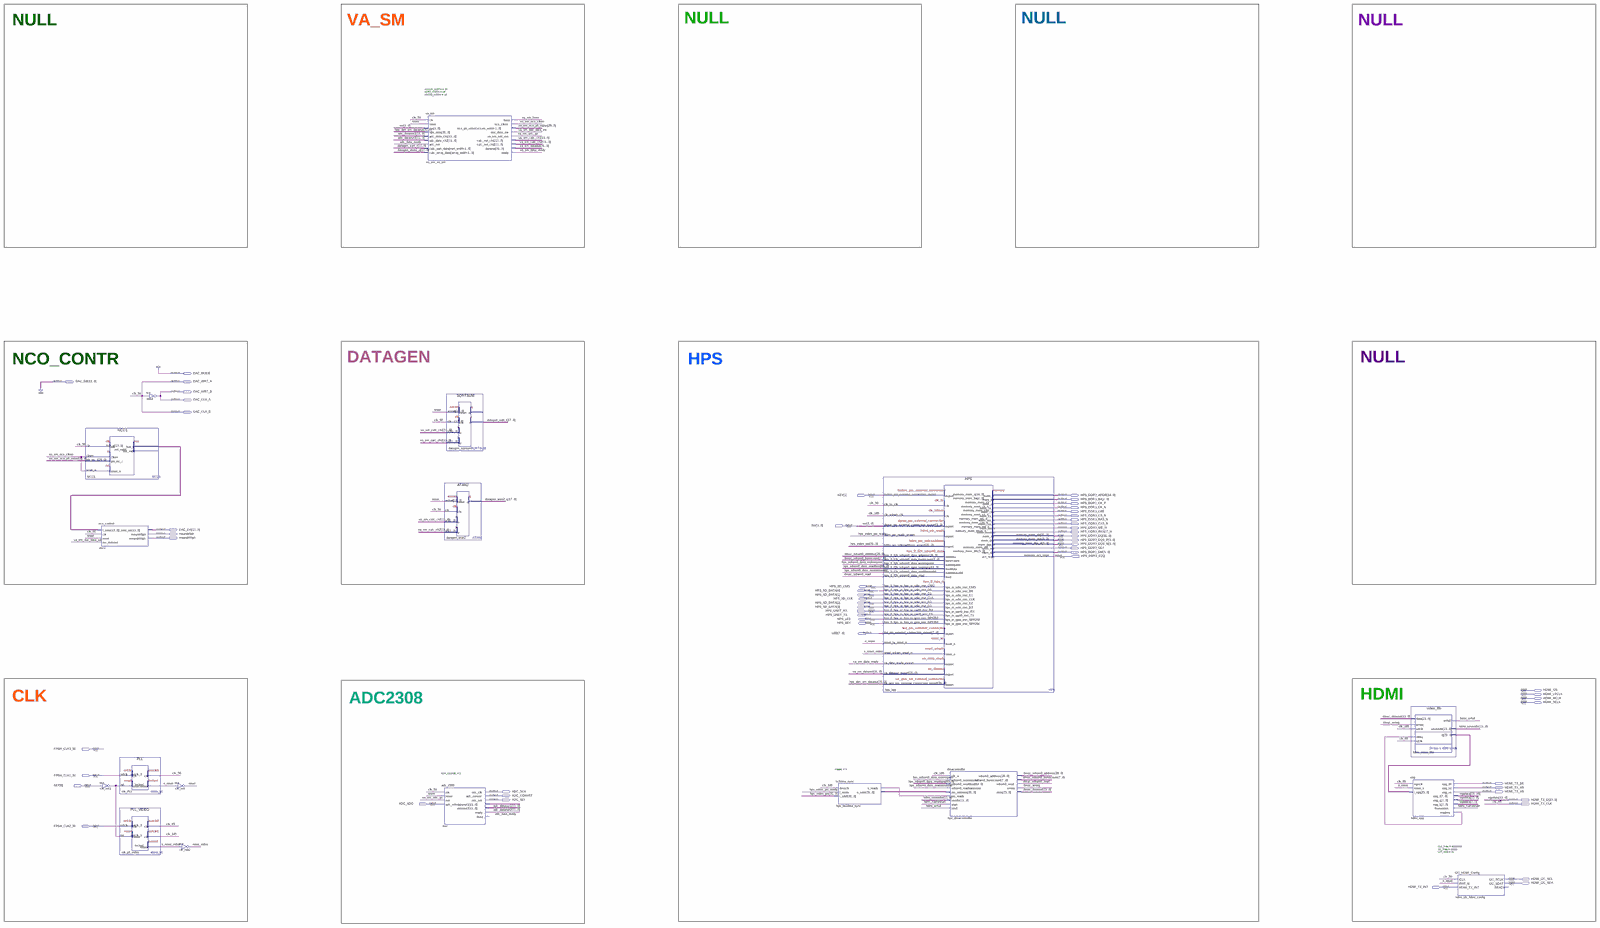
[diagram p0: schematic sheet, whole]
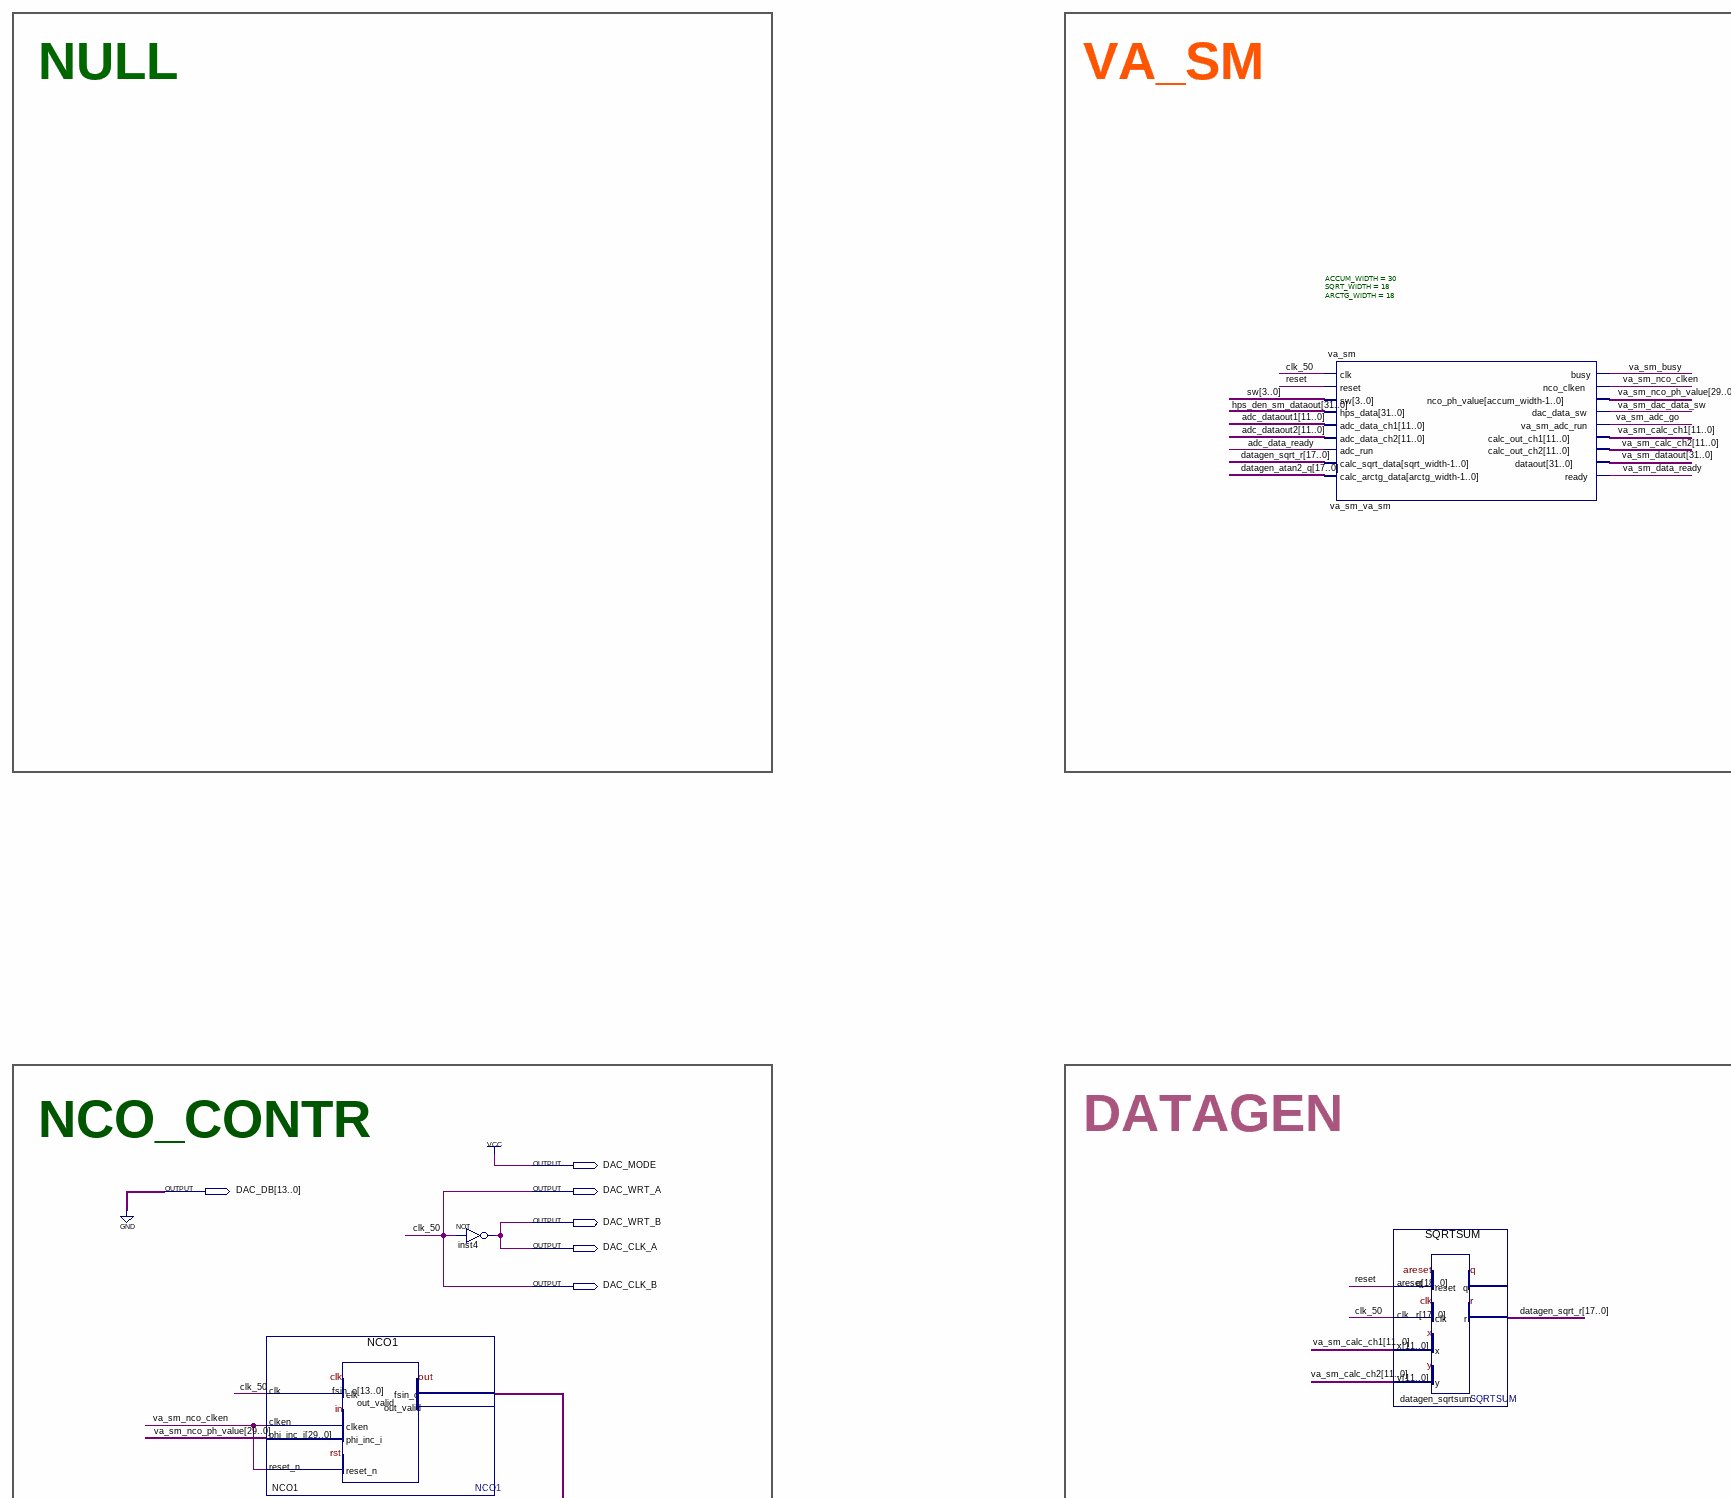
[diagram p1: schematic sheet, upper left part]
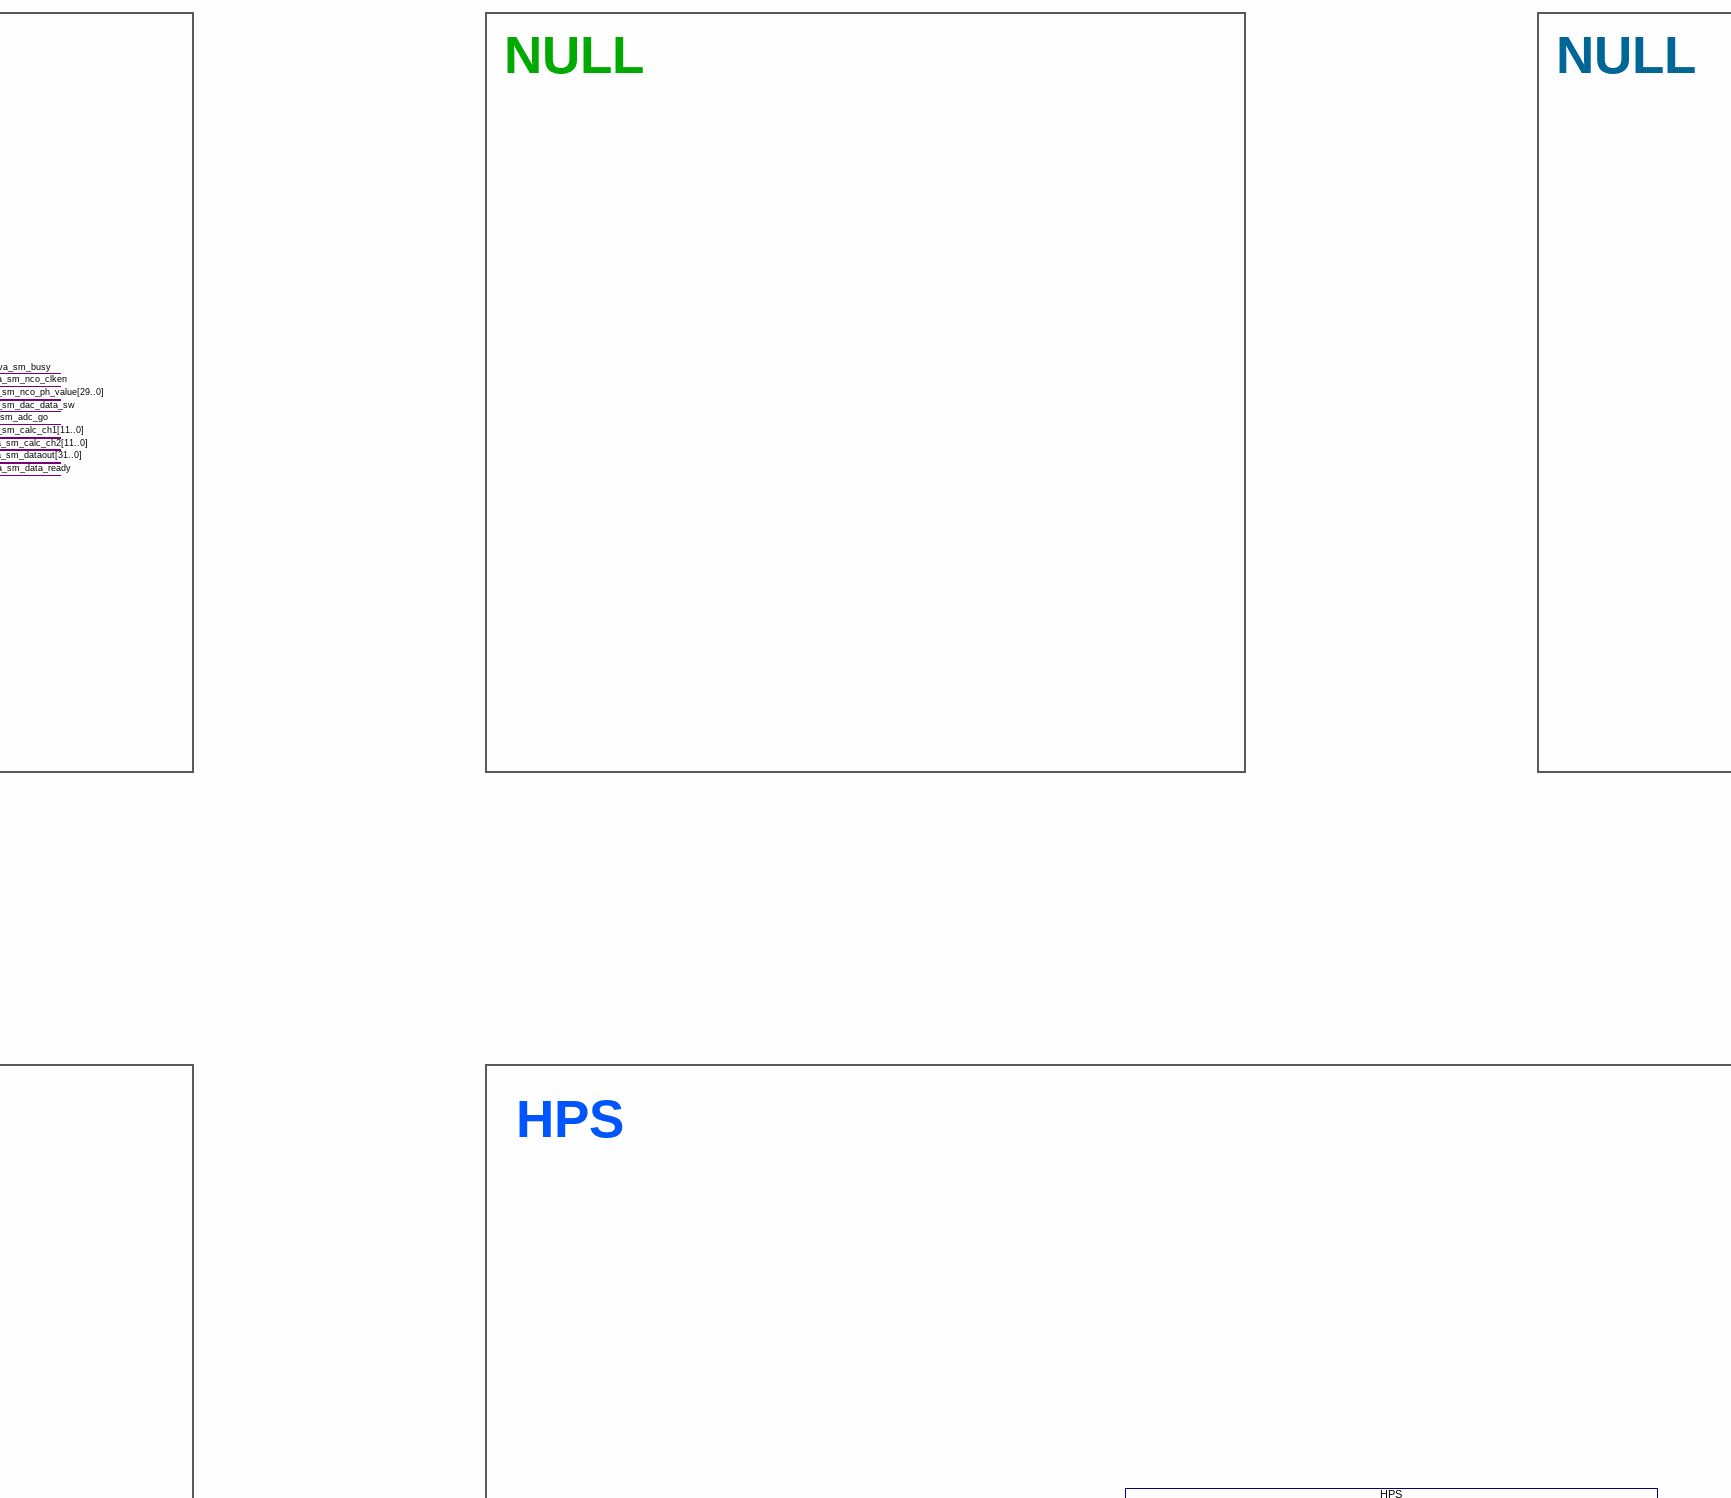
[diagram p2: schematic sheet, upper centre part]
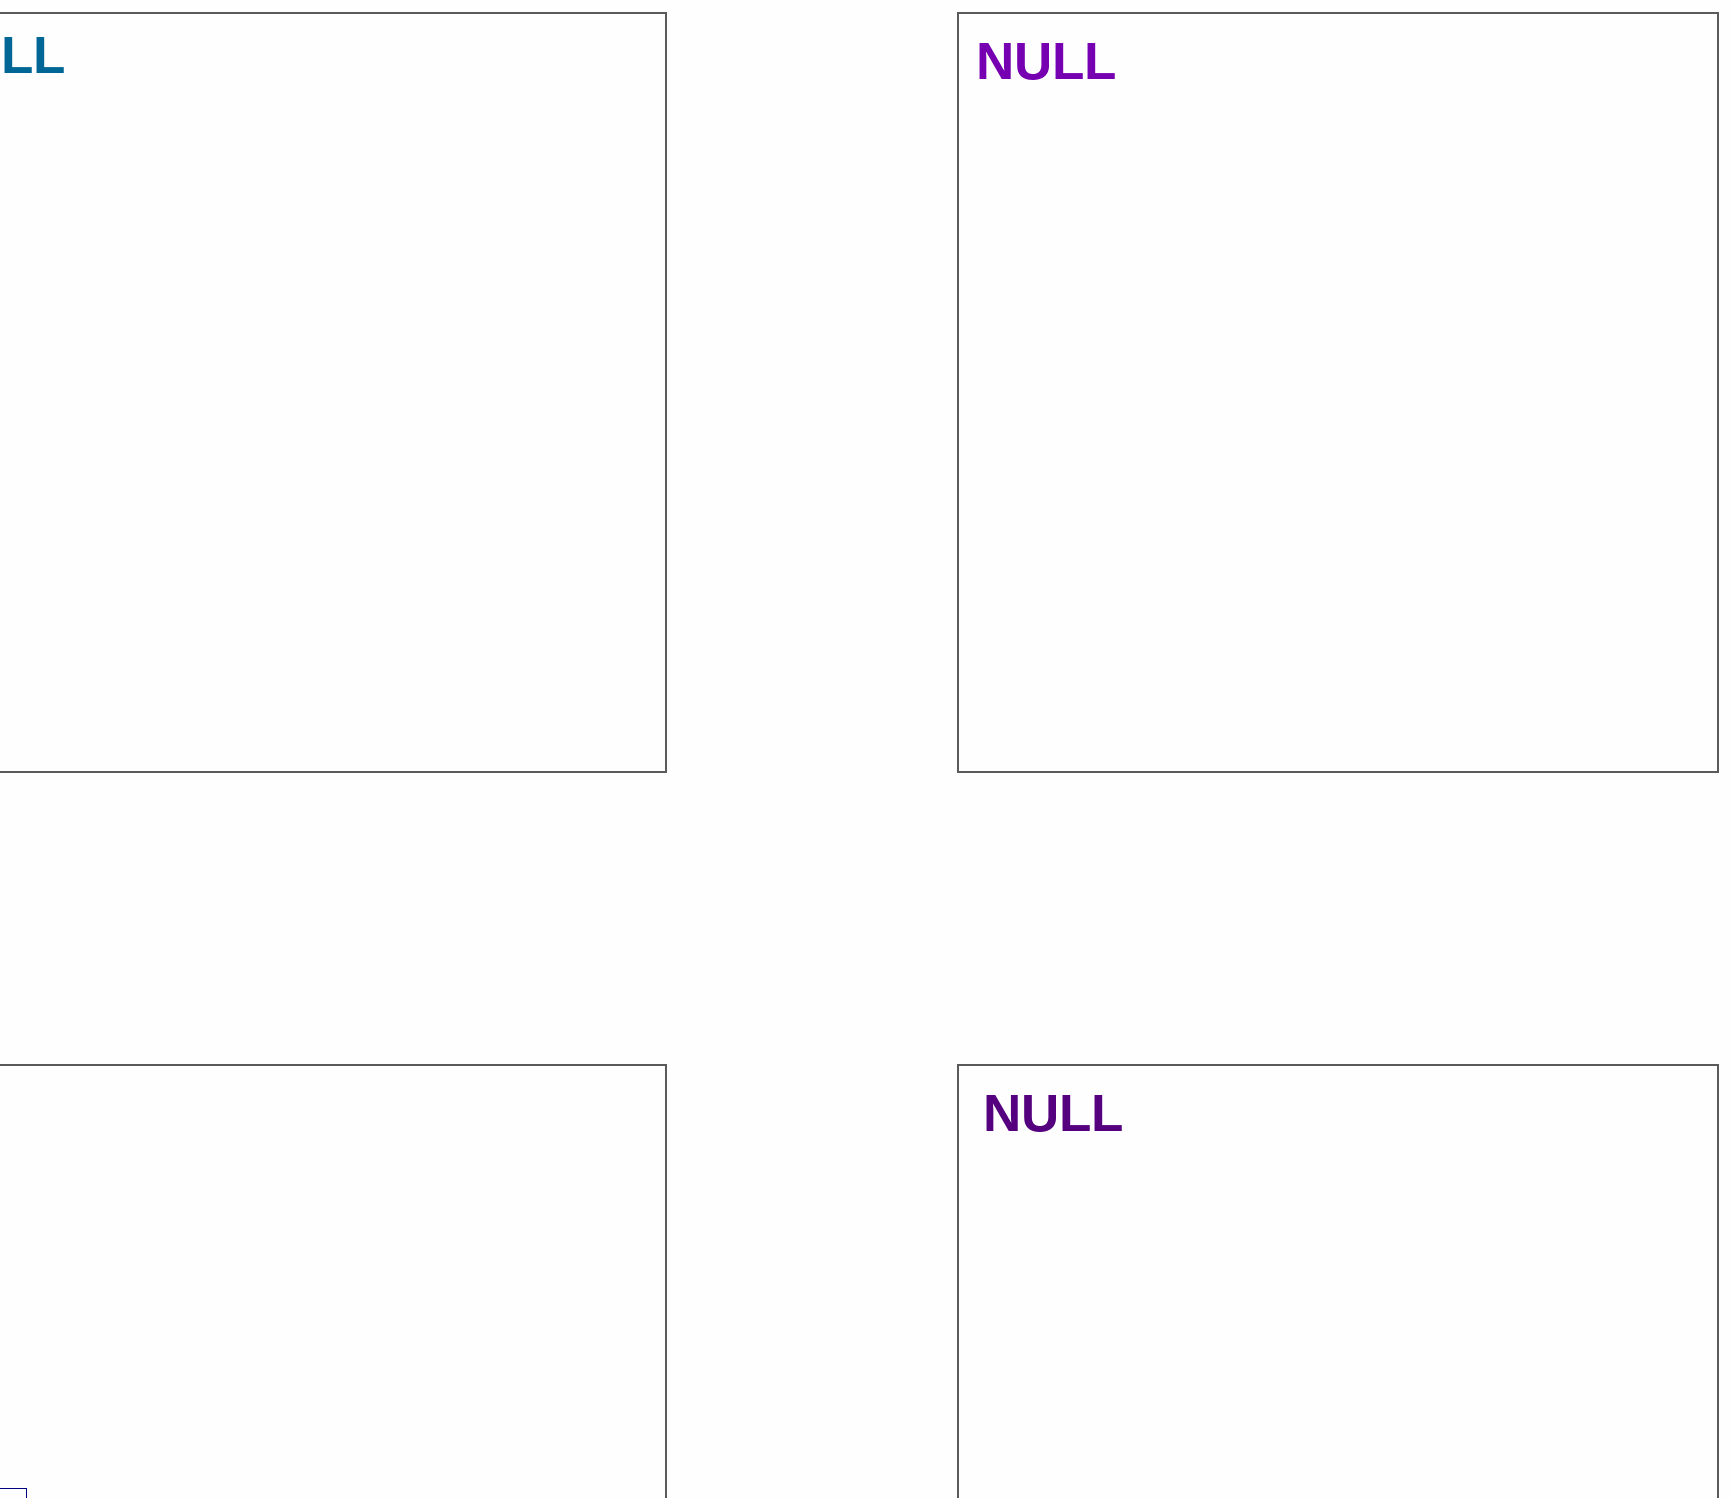
[diagram p3: schematic sheet, upper right part]
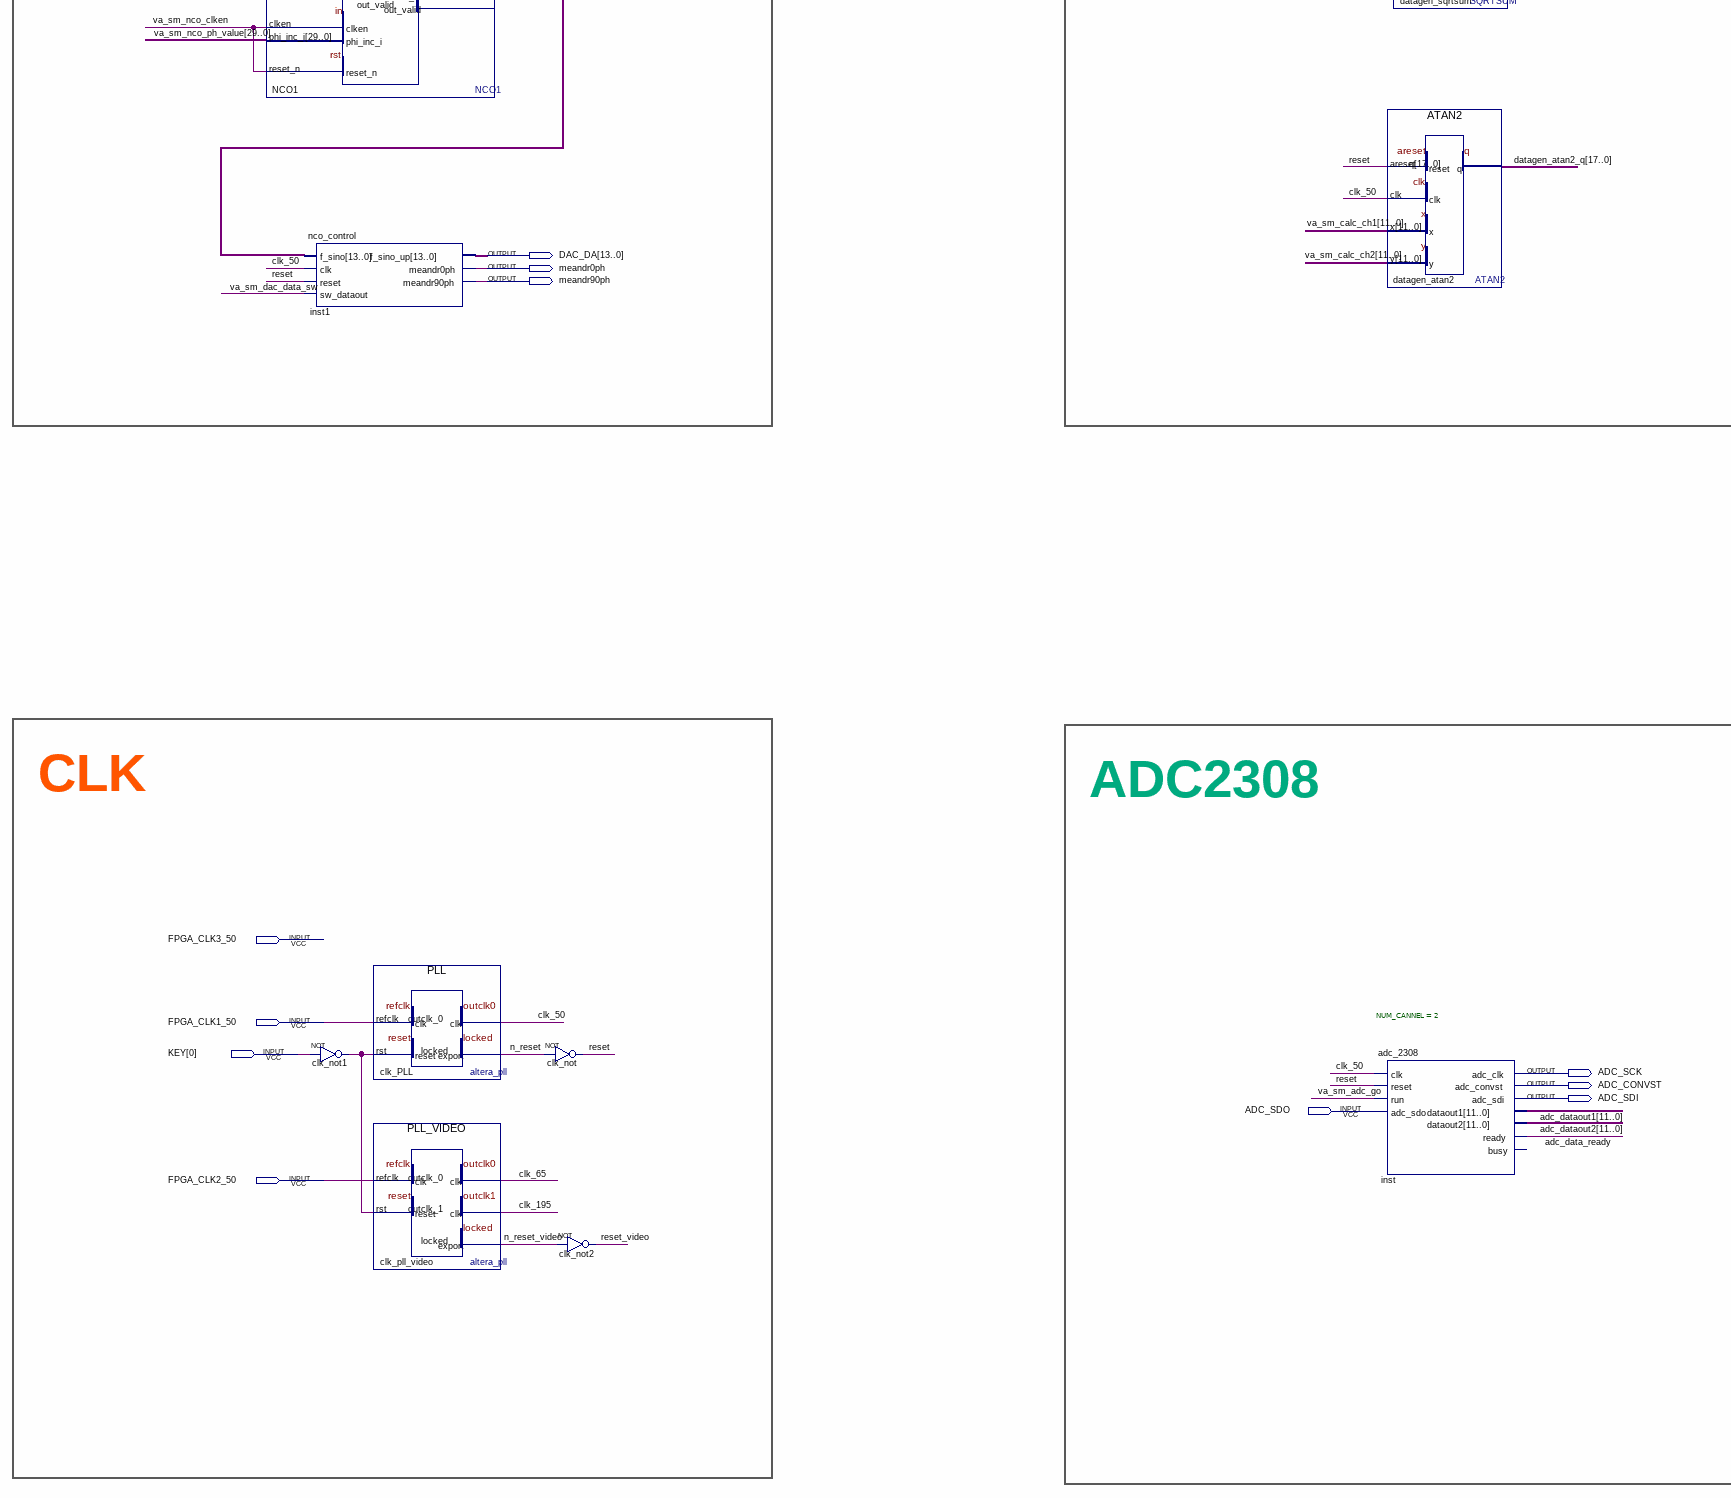
[diagram p4: schematic sheet, lower left part]
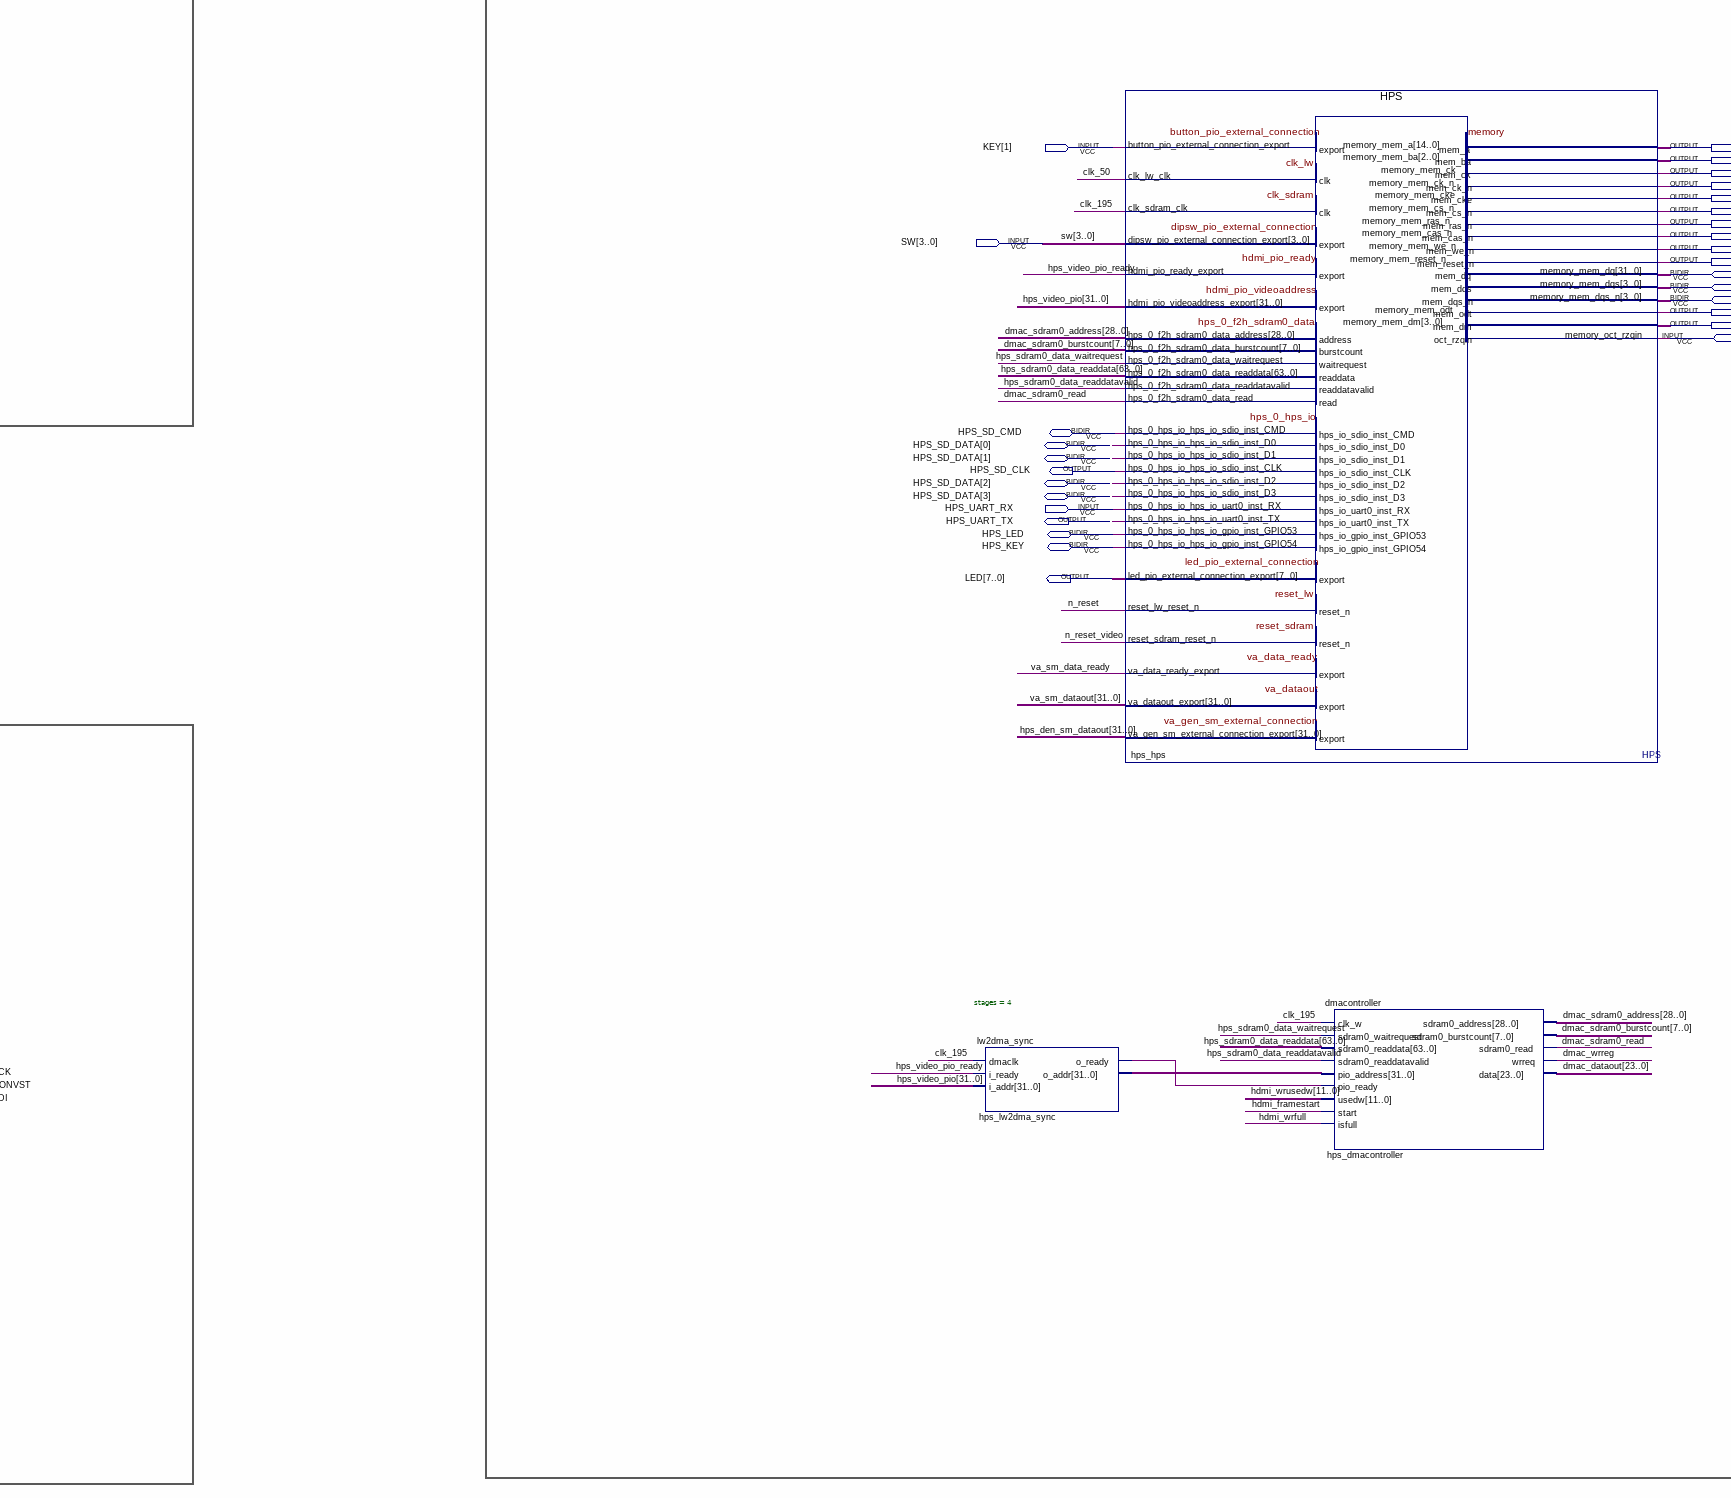
[diagram p5: schematic sheet, lower centre part]
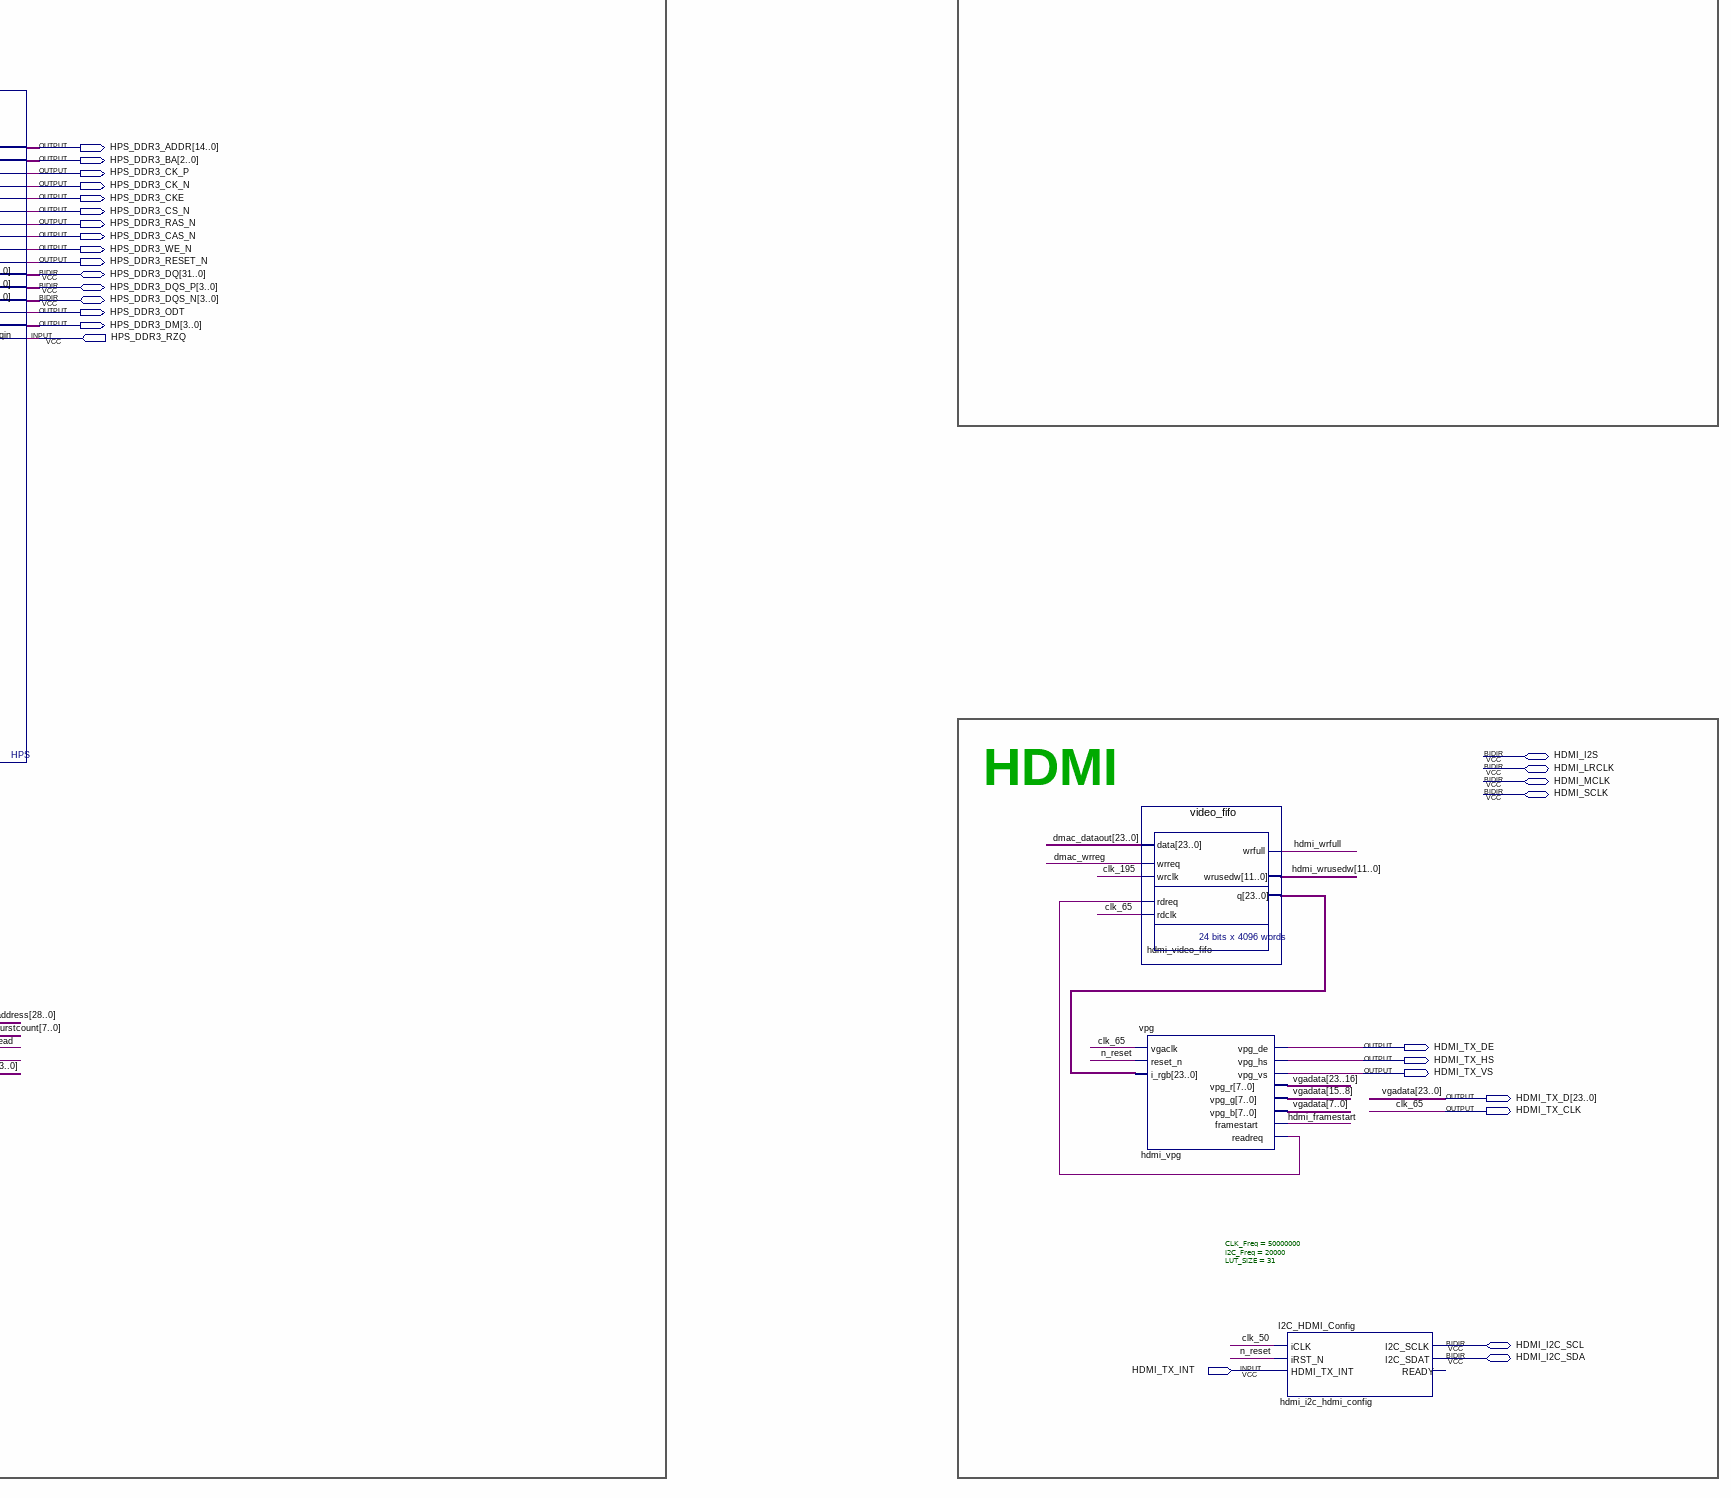
[diagram p6: schematic sheet, lower right part]
// Quartus schematic va.bdf as structural Verilog: 18 symbols, 58 pins
module va (
  input  [1:0] KEY,
  input  [3:0] SW,
  input  HPS_DDR3_RZQ,
  input  HPS_UART_RX,
  input  FPGA_CLK3_50,
  input  FPGA_CLK1_50,
  input  ADC_SDO,
  input  FPGA_CLK2_50,
  input  HDMI_TX_INT,
  inout  [31:0] HPS_DDR3_DQ,
  inout  [3:0] HPS_DDR3_DQS_P,
  inout  [3:0] HPS_DDR3_DQS_N,
  inout  HPS_SD_CMD,
  inout  [3:0] HPS_SD_DATA,
  inout  HPS_LED,
  inout  HPS_KEY,
  inout  HDMI_I2S,
  inout  HDMI_LRCLK,
  inout  HDMI_MCLK,
  inout  HDMI_SCLK,
  inout  HDMI_I2C_SCL,
  inout  HDMI_I2C_SDA,
  output DAC_MODE,
  output [13:0] DAC_DB,
  output DAC_WRT_A,
  output DAC_WRT_B,
  output DAC_CLK_A,
  output DAC_CLK_B,
  output [14:0] HPS_DDR3_ADDR,
  output [2:0] HPS_DDR3_BA,
  output HPS_DDR3_CK_P,
  output HPS_DDR3_CK_N,
  output HPS_DDR3_CKE,
  output HPS_DDR3_CS_N,
  output HPS_DDR3_RAS_N,
  output HPS_DDR3_CAS_N,
  output HPS_DDR3_WE_N,
  output [13:0] DAC_DA,
  output HPS_DDR3_RESET_N,
  output meandr0ph,
  output meandr90ph,
  output HPS_DDR3_ODT,
  output [3:0] HPS_DDR3_DM,
  output HPS_SD_CLK,
  output HPS_UART_TX,
  output [7:0] LED,
  output HDMI_TX_DE,
  output HDMI_TX_HS,
  output ADC_SCK,
  output HDMI_TX_VS,
  output ADC_CONVST,
  output ADC_SDI,
  output [23:0] HDMI_TX_D,
  output HDMI_TX_CLK
);

  wire adc_data_ready, clk_195, clk_not1_out, dmac_sdram0_read, dmac_wrreg, hdmi_framestart,
       hdmi_vpg_readreq, hdmi_wrfull, hps_lw2dma_sync_o_ready, hps_sdram0_data_readdatavalid,
       hps_sdram0_data_waitrequest, hps_video_pio_ready, n_reset, n_reset_video, reset, reset_video,
       va_sm_adc_go, va_sm_busy, va_sm_dac_data_sw, va_sm_data_ready, va_sm_nco_clken;
  wire [7:0] dmac_sdram0_burstcount;
  wire [11:0] adc_dataout1, adc_dataout2, hdmi_wrusedw, va_sm_calc_ch1, va_sm_calc_ch2;
  wire [13:0] NCO1_fsin_o;
  wire [17:0] datagen_atan2_q, datagen_sqrt_r;
  wire [23:0] dmac_dataout, hdmi_video_fifo_q;
  wire [28:0] dmac_sdram0_address;
  wire [29:0] va_sm_nco_ph_value;
  wire [31:0] hps_den_sm_dataout, hps_lw2dma_sync_o_addr, hps_video_pio, va_sm_dataout;
  wire [63:0] hps_sdram0_data_readdata;

  NCO1 NCO1 (
    .clk(DAC_CLK_B), .clken(va_sm_nco_clken), .phi_inc_i(va_sm_nco_ph_value), .reset_n(va_sm_nco_clken),
    .fsin_o(NCO1_fsin_o));  // open: out_valid
  nco_control inst1 (
    .f_sino(NCO1_fsin_o), .clk(DAC_CLK_B), .reset(reset), .sw_dataout(va_sm_dac_data_sw), .f_sino_up(DAC_DA),
    .meandr0ph(meandr0ph), .meandr90ph(meandr90ph));
  not clk_not1 (clk_not1_out, KEY[0]);
  PLL clk_PLL (.refclk(FPGA_CLK1_50), .rst(clk_not1_out), .outclk_0(DAC_CLK_B), .locked(n_reset));
  PLL_VIDEO clk_pll_video (
    .refclk(FPGA_CLK2_50), .rst(clk_not1_out), .outclk_0(HDMI_TX_CLK), .outclk_1(clk_195),
    .locked(n_reset_video));
  not inst4 (DAC_CLK_A, DAC_CLK_B);
  not clk_not (reset, n_reset);
  not clk_not2 (reset_video, n_reset_video);
  va_sm #(.ACCUM_WIDTH(30), .SQRT_WIDTH(18), .ARCTG_WIDTH(18)) va_sm_va_sm (
    .clk(DAC_CLK_B), .reset(reset), .sw(SW), .hps_data(hps_den_sm_dataout), .adc_data_ch1(adc_dataout1),
    .adc_data_ch2(adc_dataout2), .adc_run(adc_data_ready), .calc_sqrt_data(datagen_sqrt_r),
    .calc_arctg_data(datagen_atan2_q), .busy(va_sm_busy), .nco_clken(va_sm_nco_clken),
    .nco_ph_value(va_sm_nco_ph_value), .dac_data_sw(va_sm_dac_data_sw), .va_sm_adc_run(va_sm_adc_go),
    .calc_out_ch1(va_sm_calc_ch1), .calc_out_ch2(va_sm_calc_ch2), .dataout(va_sm_dataout),
    .ready(va_sm_data_ready));
  SQRTSUM datagen_sqrtsum (
    .areset(reset), .clk(DAC_CLK_B), .x(va_sm_calc_ch1), .y(va_sm_calc_ch2), .r(datagen_sqrt_r));  // open: q
  ATAN2 datagen_atan2 (.areset(reset), .clk(DAC_CLK_B), .x(va_sm_calc_ch1), .y(va_sm_calc_ch2), .q(datagen_atan2_q));
  adc_2308 #(.NUM_CANNEL(2)) inst (
    .clk(DAC_CLK_B), .reset(reset), .run(va_sm_adc_go), .adc_sdo(ADC_SDO), .adc_clk(ADC_SCK),
    .adc_convst(ADC_CONVST), .adc_sdi(ADC_SDI), .dataout1(adc_dataout1), .dataout2(adc_dataout2),
    .ready(adc_data_ready));  // open: busy
  lw2dma_sync #(.stages(4)) hps_lw2dma_sync (
    .dmaclk(clk_195), .i_ready(hps_video_pio_ready), .i_addr(hps_video_pio),
    .o_ready(hps_lw2dma_sync_o_ready), .o_addr(hps_lw2dma_sync_o_addr));
  HPS hps_hps (
    .button_pio_external_connection_export(KEY[1]), .clk_lw_clk(DAC_CLK_B), .clk_sdram_clk(clk_195),
    .dipsw_pio_external_connection_export(SW), .hps_0_f2h_sdram0_data_address(dmac_sdram0_address),
    .hps_0_f2h_sdram0_data_burstcount(dmac_sdram0_burstcount), .hps_0_f2h_sdram0_data_read(dmac_sdram0_read),
    .hps_0_hps_io_hps_io_uart0_inst_RX(HPS_UART_RX), .memory_oct_rzqin(HPS_DDR3_RZQ),
    .reset_lw_reset_n(n_reset), .reset_sdram_reset_n(n_reset_video), .va_data_ready_export(va_sm_data_ready),
    .va_dataout_export(va_sm_dataout), .hdmi_pio_ready_export(hps_video_pio_ready),
    .hdmi_pio_videoaddress_export(hps_video_pio),
    .hps_0_f2h_sdram0_data_waitrequest(hps_sdram0_data_waitrequest),
    .hps_0_f2h_sdram0_data_readdata(hps_sdram0_data_readdata),
    .hps_0_f2h_sdram0_data_readdatavalid(hps_sdram0_data_readdatavalid),
    .hps_0_hps_io_hps_io_sdio_inst_CLK(HPS_SD_CLK), .hps_0_hps_io_hps_io_uart0_inst_TX(HPS_UART_TX),
    .led_pio_external_connection_export(LED), .memory_mem_a(HPS_DDR3_ADDR), .memory_mem_ba(HPS_DDR3_BA),
    .memory_mem_ck(HPS_DDR3_CK_P), .memory_mem_ck_n(HPS_DDR3_CK_N), .memory_mem_cke(HPS_DDR3_CKE),
    .memory_mem_cs_n(HPS_DDR3_CS_N), .memory_mem_ras_n(HPS_DDR3_RAS_N), .memory_mem_cas_n(HPS_DDR3_CAS_N),
    .memory_mem_we_n(HPS_DDR3_WE_N), .memory_mem_reset_n(HPS_DDR3_RESET_N), .memory_mem_odt(HPS_DDR3_ODT),
    .memory_mem_dm(HPS_DDR3_DM), .va_gen_sm_external_connection_export(hps_den_sm_dataout),
    .hps_0_hps_io_hps_io_sdio_inst_CMD(HPS_SD_CMD), .hps_0_hps_io_hps_io_sdio_inst_D0(HPS_SD_DATA[0]),
    .hps_0_hps_io_hps_io_sdio_inst_D1(HPS_SD_DATA[1]), .hps_0_hps_io_hps_io_sdio_inst_D2(HPS_SD_DATA[2]),
    .hps_0_hps_io_hps_io_sdio_inst_D3(HPS_SD_DATA[3]), .hps_0_hps_io_hps_io_gpio_inst_GPIO53(HPS_LED),
    .hps_0_hps_io_hps_io_gpio_inst_GPIO54(HPS_KEY), .memory_mem_dq(HPS_DDR3_DQ),
    .memory_mem_dqs(HPS_DDR3_DQS_P), .memory_mem_dqs_n(HPS_DDR3_DQS_N));
  dmacontroller hps_dmacontroller (
    .clk_w(clk_195), .sdram0_waitrequest(hps_sdram0_data_waitrequest),
    .sdram0_readdata(hps_sdram0_data_readdata), .sdram0_readdatavalid(hps_sdram0_data_readdatavalid),
    .pio_address(hps_lw2dma_sync_o_addr), .pio_ready(hps_lw2dma_sync_o_ready), .usedw(hdmi_wrusedw),
    .start(hdmi_framestart), .isfull(hdmi_wrfull), .sdram0_address(dmac_sdram0_address),
    .sdram0_burstcount(dmac_sdram0_burstcount), .sdram0_read(dmac_sdram0_read), .wrreq(dmac_wrreg),
    .data(dmac_dataout));
  video_fifo hdmi_video_fifo (
    .data(dmac_dataout), .wrreq(dmac_wrreg), .wrclk(clk_195), .rdreq(hdmi_vpg_readreq), .rdclk(HDMI_TX_CLK),
    .wrfull(hdmi_wrfull), .wrusedw(hdmi_wrusedw), .q(hdmi_video_fifo_q));
  vpg hdmi_vpg (
    .vgaclk(HDMI_TX_CLK), .reset_n(n_reset), .i_rgb(hdmi_video_fifo_q), .vpg_de(HDMI_TX_DE),
    .vpg_hs(HDMI_TX_HS), .vpg_vs(HDMI_TX_VS), .vpg_r(HDMI_TX_D[23:16]), .vpg_g(HDMI_TX_D[15:8]),
    .vpg_b(HDMI_TX_D[7:0]), .framestart(hdmi_framestart), .readreq(hdmi_vpg_readreq));
  I2C_HDMI_Config #(.CLK_Freq(50000000), .I2C_Freq(20000), .LUT_SIZE(31)) hdmi_i2c_hdmi_config (
    .iCLK(DAC_CLK_B), .iRST_N(n_reset), .HDMI_TX_INT(HDMI_TX_INT), .I2C_SCLK(HDMI_I2C_SCL),
    .I2C_SDAT(HDMI_I2C_SDA));  // open: READY

  assign DAC_DB = {14{1'b0}};
  assign DAC_MODE = 1'b1;
  assign DAC_WRT_A = DAC_CLK_B;
  assign DAC_WRT_B = DAC_CLK_A;

  // Other names for the same wires on the sheet: clk_50 = DAC_CLK_B; clk_65 = HDMI_TX_CLK; vgadata[23:0] = HDMI_TX_D

  // Notes on the sheet:
  //   NULL
  //   NULL
  //   NULL
  //   VA_SM
  //   NULL
  //   DATAGEN
  //   NULL
  //   NCO_CONTR
  //   HPS
  //   HDMI
  //   CLK
  //   ADC2308
endmodule
